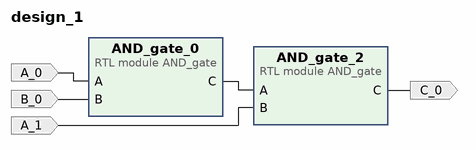
[diagram p0: block diagram of the top level]
# Vivado block design design_1, xc7z020clg400-1, Vivado 2023.2
create_bd_design design_1

create_bd_port -dir I A_0
create_bd_port -dir I B_0
create_bd_port -dir I A_1
create_bd_port -dir O C_0

create_bd_cell -type module -reference AND_gate AND_gate_0
create_bd_cell -type module -reference AND_gate AND_gate_2

# ---- connections ----

connect_bd_net [get_bd_pins AND_gate_0/C] [get_bd_pins AND_gate_2/A]
connect_bd_net [get_bd_pins AND_gate_2/C] [get_bd_ports C_0]
connect_bd_net -net A_0_1 [get_bd_ports A_0] [get_bd_pins AND_gate_0/A]
connect_bd_net -net A_1_1 [get_bd_ports A_1] [get_bd_pins AND_gate_2/B]
connect_bd_net -net B_0_1 [get_bd_ports B_0] [get_bd_pins AND_gate_0/B]

validate_bd_design
save_bd_design
